# Altium schematic sheet OpenPLCv0.2.0_RS485.SchDoc
size 420 x 297 mm; PageSetup: Record=PageOptions|CenterHorizontal=True|CenterVertical=True|PrintScale=1.01|XCorrection=1.00|YCorrection=1.00|PrintKind=1|BorderSize=5000000|LeftOffset=0|BottomOffset=0|Orientation=2|PaperLength=1000|PaperWidth=1000|Scale=100|PaperSource=7|PrintQuality=-4|MediaType=1|DitherType=10|PaperKind=A3|PrintScaleMode=1; DocumentNumber: 21; SheetNumber: 21; SheetTotal: 22; SheetTitle: RS485 Transceiver
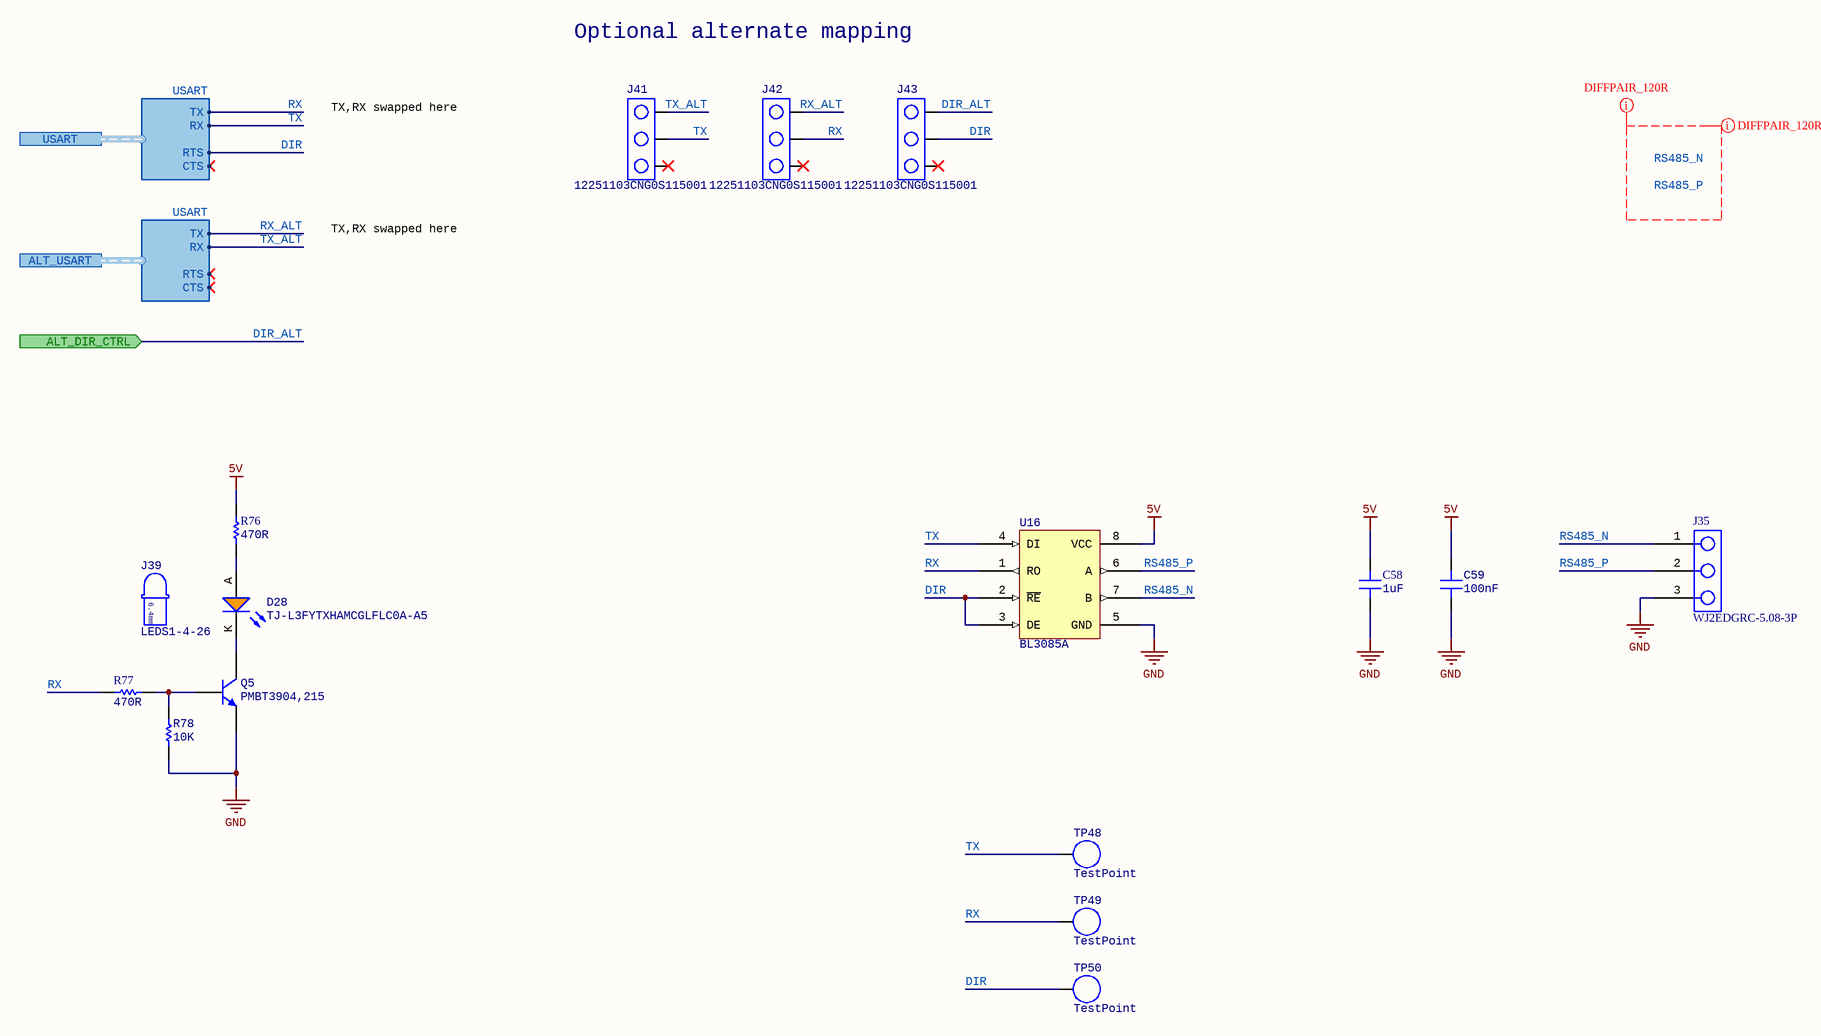
[diagram p0: OpenPLCv0.2.0_RS485.SchDoc]

## Parts
C58  Capacitance: 1uF  [SMD_CAP_0603(0201)_N]  (hidden comment: CC0603KRX5R9BB105)
C59  Capacitance: 100nF  [SMD_CAP_0402(1005)_N]  (hidden comment: CC0402KRX5R6BB104)
D28  TJ-L3FYTXHAMCGLFLC0A-A5  [LED_3MM_SPACED_6.4MM_YELLOW]
J35  WJ2EDGRC-5.08-3P  [796638-3_BoardEdgeAlt]
J39  LEDS1-4-26  [3MM_LED_SPACER_6.4MM]
J41  12251103CNG0S115001  [Header_3POS]
J42  12251103CNG0S115001  [Header_3POS]
J43  12251103CNG0S115001  [Header_3POS]
Q5  PMBT3904,215  [SOT23-3]
R76  Resistance: 470R  [SMD_RES_0402(1005)_N]  (hidden comment: RC0402FR-07470RL)
R77  Resistance: 470R  [SMD_RES_0402(1005)_N]  (hidden comment: RC0402FR-07470RL)
R78  Resistance: 10K  [SMD_RES_0402(1005)_N]  (hidden comment: RC0402FR-0710KL)
TP48  TestPoint  [Pad]  (no BOM)
TP49  TestPoint  [Pad]  (no BOM)
TP50  TestPoint  [Pad]  (no BOM)
U16  BL3085A  [SOIC-8-3.9mm]

## Ports
ALT_DIR_CTRL (in), ALT_USART (harness USART), USART (harness USART)

## Harnesses
USART: TX, RX, RTS, CTS

## Nets
5V: C58.2 C59.2 R76.2 U16.8(VCC)
GND: C58.1 C59.1 J35.3 Q5.2(E) R78.1 U16.5(GND)
DIR: J43.2 TP50.1 U16.2(~{RE}) U16.3(DE) ; port USART.RTS
DIR_ALT: J43.1 ; port ALT_DIR_CTRL
RS485_N: J35.1 U16.7(B)
RS485_P: J35.2 U16.6(A)
RX: J42.2 R77.2 TP49.1 U16.1(RO) ; port USART.TX
RX_ALT: J42.1 ; port ALT_USART.TX
TX: J41.2 TP48.1 U16.4(DI) ; port USART.RX
TX_ALT: J41.1 ; port ALT_USART.RX
NetD28_A: D28.A R76.1
NetD28_K: D28.K Q5.3(C)
NetQ5_1: Q5.1(B) R77.1 R78.2

Not connected (* = marked no-connect by the designer): J41 3*; J42 3*; J43 3*

## Layout directives
differential pair; differential pair class 120R_DIFF_PAIRS; net class 120R_PAIRS: RS485_N, RS485_P
mark named DIFFPAIR_120R: RS485_N, RS485_P

## Notes on the sheet
- Optional alternate mapping
- TX,RX swapped here
- Labels drawn without touching a wire or pin: RS485_N, RS485_P
- FILE NAME
- PROJECT
- TITLE
- REV
- AUTHOR
- SIZE
- SHEET
- DATE
- OF
- A3
- (in symbol LEDS1-4-26) 6.4mm

## Library data of the parts
C58 = 1uF 0603 50V 10%: 1uF ±10% 50V X5R 0603 Multilayer Ceramic Capacitors MLCC - SMD/SMT RoHS; Package: 0603; Tolerance: 10%; Voltage Rating: 50V
C59 = 100nF 0402 10V 10%: 100nF ±10% 10V X5R 0402 Multilayer Ceramic Capacitors MLCC - SMD/SMT RoHS; Package: 0402; Tolerance: 10%; Voltage Rating: 10V
D28 = TJ-L3FYTXHAMCGLFLC0A-A5: 600nm~610nm 1.8V~2.6V - - Through Hole Light Emitting Diodes (LED) ROHS 3mm
J35 = WJ2EDGRC-5.08-3P: Covered（4Sided） 3 1 0.200"（5.08mm） 3 P=5.08mm Pluggable System Terminal Block RoHS
J39 = LEDS1-4-26: 3mm LED spacer 6.4mm height
J41-J43 = 3-way Jumper: Pin Header 3 1 right-angle，180degrees 2.54mm Through Hole,P=2.54mm Pin Header & Female Header RoHS
Q5 = PMBT3904,215: NPN 200mA 40V 250mW SOT-23(SOT-23-3) Transistors (NPN/PNP) RoHS
R76 R77 = 470R 0402 1% 1W: 470Ω ±1% 1/16W ±100ppm/℃ 0402 Chip Resistor - Surface Mount RoHS; Power Rating: 1W; Package: 0402; Tolerance: 1%
R78 = 10K 0402 1% 1/16W: 10kΩ ±1% 1/16W ±100ppm/℃ 0402 Chip Resistor - Surface Mount RoHS; Package: 0402; Tolerance: 1%; Power Rating: 1/16W
TP48-TP50 = Test point
U16 = BL3085A: SOIC-8_150mil RS-485/RS-422 ICs ROHS (MAX485 clone)